# EAGLE design LoRaIOX_FW_RevA (EAGLE 7.2.0)
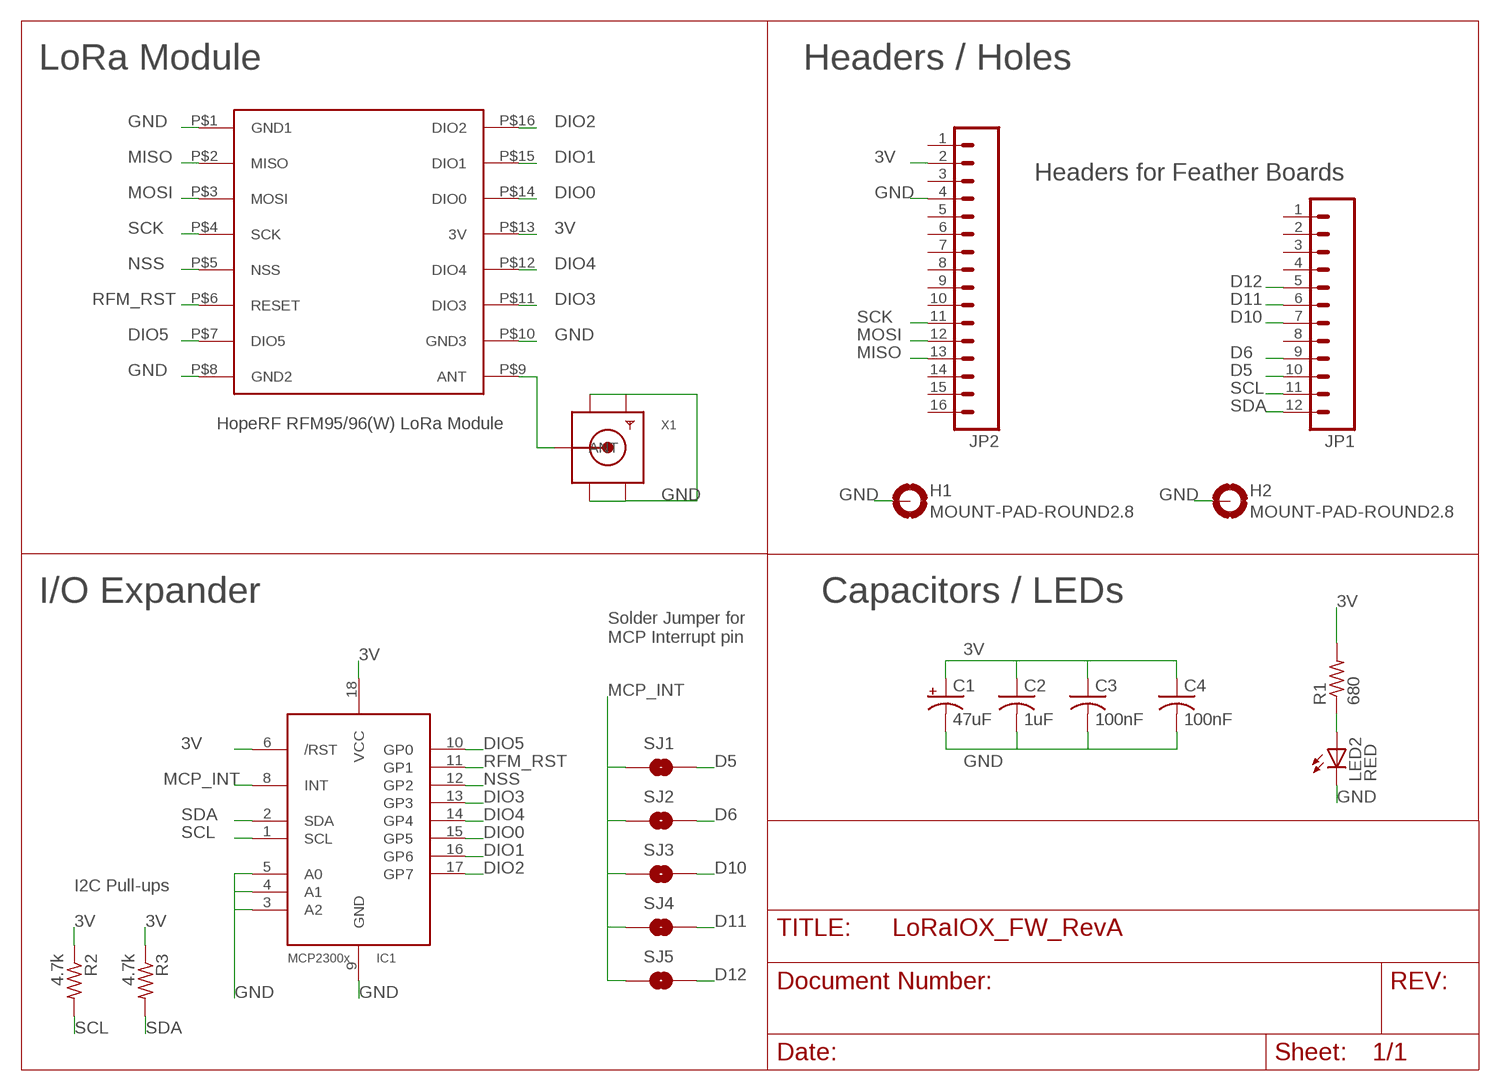
[diagram p0: schematic, sheet 1]

## Parts
C1  47uF  47UF-10V-10%(TANT)  [EIA3528]
C2  1uF  C-USC0603  [C0603]
C3  100nF  C-USC0603  [C0603]
C4  100nF  C-USC0603  [C0603]
H1  MOUNT-PAD-ROUND2.8  [2,8-PAD]
H2  MOUNT-PAD-ROUND2.8  [2,8-PAD]
IC1  MCP2300X/SO  [SO18W]
JP1  M12NO_SILK  [1X12_NO_SILK]
JP2  M161X16_NO_SILK  [1X16_NO_SILK]
LED2  RED  LEDCHIPLED_0805  [CHIPLED_0805]
R1  680  R-US_R0603  [R0603]
R2  4.7k  R-US_R0603  [R0603]
R3  4.7k  R-US_R0603  [R0603]
SJ1  JUMPER-PAD-2-NOYES_SILK  [PAD-JUMPER-2-NO_YES_SILK]
SJ2  JUMPER-PAD-2-NOYES_SILK  [PAD-JUMPER-2-NO_YES_SILK]
SJ3  JUMPER-PAD-2-NOYES_SILK  [PAD-JUMPER-2-NO_YES_SILK]
SJ4  JUMPER-PAD-2-NOYES_SILK  [PAD-JUMPER-2-NO_YES_SILK]
SJ5  JUMPER-PAD-2-NOYES_SILK  [PAD-JUMPER-2-NO_YES_SILK]
U$2  RFM95W  [RFM95W]
X1  SMACONNECTOR_EDGE  [SMA_EDGELAUNCH]

## Nets
3V: C1.A(+) C2.1 C3.1 C4.1 IC1.6(/RST) IC1.18(VCC) JP2.2 R1.2 R2.1 R3.1 U$2.P$13(3V)
ANT: U$2.P$9(ANT) X1.P(ANT)
D5: JP1.10 SJ1.2
D6: JP1.9 SJ2.2
D10: JP1.7 SJ3.2
D11: JP1.6 SJ4.2
D12: JP1.5 SJ5.2
DIO0: IC1.15(GP5) U$2.P$14(DIO0)
DIO1: IC1.16(GP6) U$2.P$15(DIO1)
DIO2: IC1.17(GP7) U$2.P$16(DIO2)
DIO3: IC1.13(GP3) U$2.P$11(DIO3)
DIO4: IC1.14(GP4) U$2.P$12(DIO4)
DIO5: IC1.10(GP0) U$2.P$7(DIO5)
GND: C1.C(-) C2.2 C3.2 C4.2 H1.B2,8(MOUNT) H2.B2,8(MOUNT) IC1.3(A2) IC1.4(A1) IC1.5(A0) IC1.9(GND) JP2.4 LED2.C U$2.P$1(GND1) U$2.P$8(GND2) U$2.P$10(GND3) X1.GND@1(GND4) X1.GND@2(GND3) X1.GND@3(GND2) X1.GND@4(GND1)
MCP_INT: IC1.8(INT) SJ1.1 SJ2.1 SJ3.1 SJ4.1 SJ5.1
MISO: JP2.13 U$2.P$2(MISO)
MOSI: JP2.12 U$2.P$3(MOSI)
N$9: LED2.A R1.1
NSS: IC1.12(GP2) U$2.P$5(NSS)
RFM_RST: IC1.11(GP1) U$2.P$6(RESET)
SCK: JP2.11 U$2.P$4(SCK)
SCL: IC1.1(SCL) JP1.11 R2.2
SDA: IC1.2(SDA) JP1.12 R3.2
Unconnected: JP1.1 JP1.2 JP1.3 JP1.4 JP1.8 JP2.1 JP2.3 JP2.5 JP2.6 JP2.7 JP2.8 JP2.9 JP2.10 JP2.14 JP2.15 JP2.16

## Notes on the sheet
- LoRa Module | Headers / Holes
- Headers for Feather Boards
- HopeRF RFM95/96(W) LoRa Module
- I/O Expander | Capacitors / LEDs
- Solder Jumper for
  MCP Interrupt pin
- I2C Pull-ups

## Library data of the parts
C1 = SparkFun-Capacitors:47UF-10V-10%(TANT): CAP-08310 47uF Tantalum SMT 10V 10% (EIA-3528); PROD_ID: CAP-08310
C2-C4 = adafruit:C-US: CAPACITOR, American symbol
H1 H2 = holes:MOUNT-PAD-ROUND: MOUNTING PAD, round
IC1 = adafruit:MCP2300X: MCP23008 Inexpensive i2c i/o expander - 8 general purpose i/o pins with optional pullups
JP1 = SparkFun-Connectors:M12: Header 12 Standard 12-pin 0.1" header. Use with straight break away headers (SKU : PRT-00116), right angle break away headers (PRT-00553), swiss pins (PRT-00743), machine pins (PRT-00117), and female headers (PRT-00115).
JP2 = SparkFun-Connectors:M16: 1x16 .1" header
LED2 = adafruit:LED: LED OSRAM: - CHIPLED LG R971, LG N971, LY N971, LG Q971, LY Q971, LO R971, LY R971 LH N974, LH R974 LS Q976, LO Q976, LY Q976 LO Q996 - Hyper CHIPLED LW Q18S LB Q993, LB Q99A, LB R99A - SideLED LS A670, LO A670, LY A670, LG A670, LP A670 LB A673, LV A673, LT A673, LW A673 LH A674 LY A675 LS A676, LA A676, LO A676, LY A676, LW A676 LS A679, LY A679, LG A679 - Hyper Micro SIDELED® LS Y876, LA Y876, LO Y876, LY Y876 LT Y87S - SmartLED LW L88C, LW L88S LB L89C, LB L89S, LG L890 LS L89K, LO L89K, LY L89K LS L896, LA L896, LO L896, LY L896 - TOPLED LS T670, LO T670, LY T670, LG T670, LP T670 LSG T670, LSP T670, LSY T670, LOP T670, LYG T670 LG T671, LOG T671, LSG T671 LB T673, LV T673, LT T673, LW T673 LH T674 LS T676, LA T676, LO T676, LY T676, LB T676, LH T676, LSB T676, LW T676 LB T67C, LV T67C, LT T67C, LS T67K, LO T67K, LY T67K, LW E67C LS E67B, LA E67B, LO E67B, LY E67B, LB E67C, LV E67C, LT E67C LW T67C LS T679, LY T679, LG T679 LS T770, LO T770, LY T770, LG T770, LP T770 LB T773, LV T773, LT T773, LW T773 LH T774 LS E675, LA E675, LY E675, LS T675 LS T776, LA T776, LO T776, LY T776, LB T776 LHGB T686 LT T68C, LB T68C - Hyper Mini TOPLED® LB M676 - Mini TOPLED Santana® LG M470 LS M47K, LO M47K, LY M47K Source: http://www.osram.convergy.de/
R1-R3 = adafruit2:R-US_: RESISTOR, American symbol
SJ1-SJ5 = SparkFun-Passives:JUMPER-PAD-2-NO
U$2 = _CustomParts:RFM95W
X1 = adafruit:SMACONNECTOR: SMA Connector 90° DIP SMA Connector, 50 Ohm (4UConnector: 07259)

## Net classes
1 power: width 0.305 mm

## Board
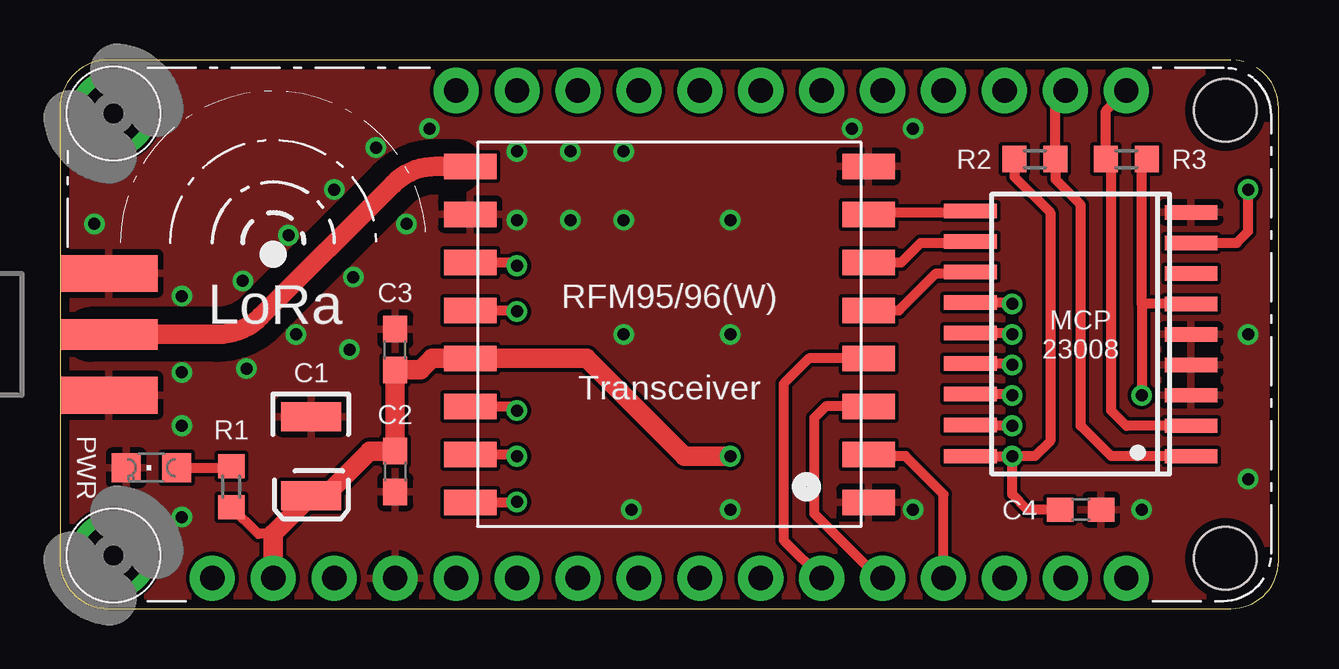
[diagram p1: board, top side]
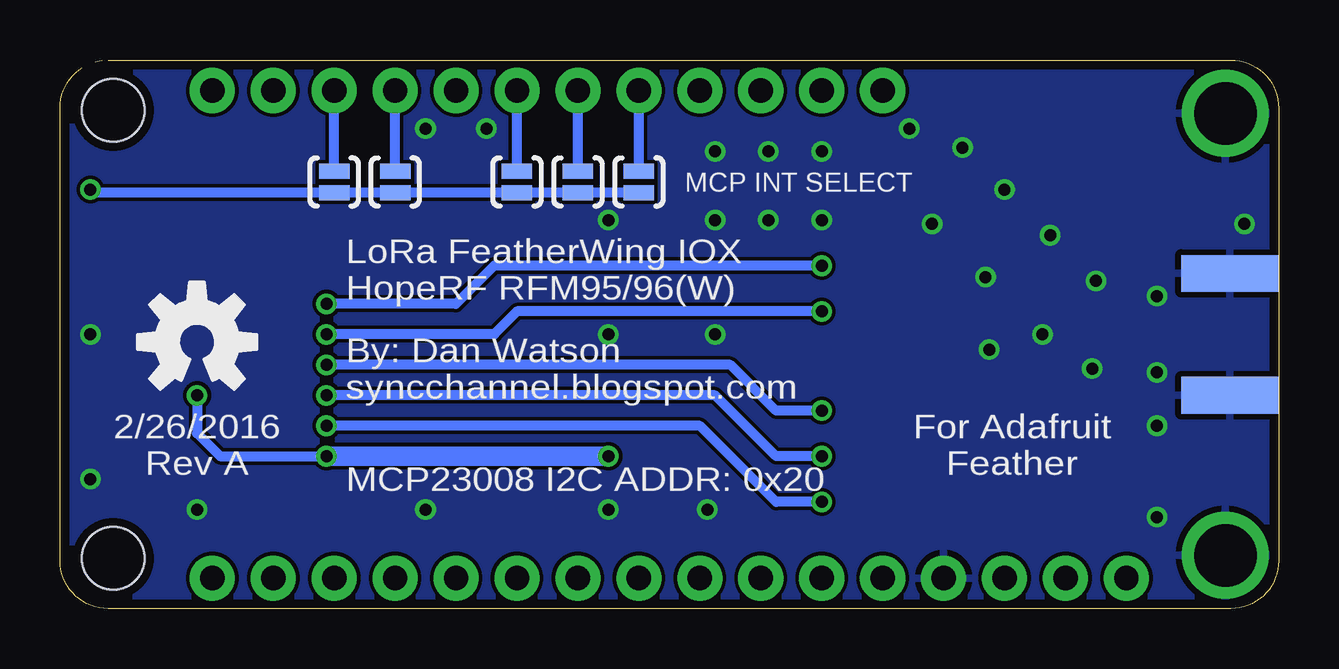
[diagram p2: board, bottom side, seen from below]

Size 50.8 x 22.86 mm. Coordinates in mm from the lower left corner, seen from the top.
Outline: 0,20.86 0,2 arc90 2,0 48.8,0 arc90 50.8,2 50.8,20.86 arc90 48.8,22.86 2,22.86 arc90 0,20.86
Copper layers (1*16): Top 0.0356mm / dielectric 1.5011mm / Bottom 0.0356mm
Design rules "oshpark-2layer *": minimum track width 6mil, minimum drill 13mil, track to track 6mil, track to pad 6mil, pad to pad 6mil, via to via 6mil, smd to smd 6mil, copper to edge 15mil, drill to drill 6mil, minimum pad ring 7mil, minimum via ring 7mil, stop-mask expansion 4mil, vias tented up to drill 20mil, thermal gap 10mil
Holes 2.6 mm at 48.58,20.76 48.58,2.1
tRestrict: 5 lines

### Footprints (pad centres in the part's own frame; a part is rotated, then mirrored left to right if it is on the bottom)
EIA3528 = smd 1.2 x 2.5: A 1.65,0; C -1.65,0
C0603 = smd 1.1 x 1: 1 -0.85,0; 2 0.85,0
2,8-PAD = drill 2.6 pad 3.6: B2,8 0,0
SO18W = smd 0.6 x 2.2: 1 -4.445,-4.6; 2 -3.175,-4.6; 3 -1.905,-4.6; 4 -0.635,-4.6; 5 0.635,-4.6; 6 1.905,-4.6; 7 3.175,-4.6; 8 4.445,-4.6; 9 5.715,-4.6; 10 5.775,4.6; 11 4.505,4.6; 12 3.235,4.6; 13 1.965,4.6; 14 0.695,4.6; 15 -0.575,4.6; 16 -1.845,4.6; 17 -3.145,4.6; 18 -4.445,4.6
1X12_NO_SILK = drill 1.016 pad 1.88: 1 0,0; 2 2.54,0; 3 5.08,0; 4 7.62,0; 5 10.16,0; 6 12.7,0; 7 15.24,0; 8 17.78,0; 9 20.32,0; 10 22.86,0; 11 25.4,0; 12 27.94,0
1X16_NO_SILK = drill 1.016 pad 1.88: 1 0,0; 2 2.54,0; 3 5.08,0; 4 7.62,0; 5 10.16,0; 6 12.7,0; 7 15.24,0; 8 17.78,0; 9 20.32,0; 10 22.86,0; 11 25.4,0; 12 27.94,0; 13 30.48,0; 14 33.02,0; 15 35.56,0; 16 38.1,0
CHIPLED_0805 = smd 1.2 x 1.2: A 0,-1.05; C 0,1.05
R0603 = smd 1 x 1.1: 1 -0.85,0; 2 0.85,0
PAD-JUMPER-2-NO_YES_SILK = smd 0.635 x 1.27: 1 -0.45,0; 2 0.45,0
RFM95W = smd 2.184 x 1.067: P$1 -8.3,7; P$2 -8.3,5; P$3 -8.3,3; P$4 -8.3,1; P$5 -8.3,-1; P$6 -8.3,-3; P$7 -8.3,-5; P$8 -8.3,-7; P$9 8.3,-7; P$10 8.3,-5; P$11 8.3,-3; P$12 8.3,-1; P$13 8.3,1; P$14 8.3,3; P$15 8.3,5; P$16 8.3,7
SMA_EDGELAUNCH = smd 4.064 x 1.524: GND@1 2.032,-2.54; GND@2 2.032,2.54 | smd 4.064 x 1.524 bottom: GND@3 2.032,2.54; GND@4 2.032,-2.54 | smd 4.064 x 1.27: P 2.032,0

### Placement (x,y rotation side)
C1  10.48,6.35 270 top
C2  13.97,10.79 90 top
C3  13.97,5.71 270 top
C4  42.55,4.13 0 top
H1  2.22,20.64 0 top
H2  2.22,2.22 0 top
IC1  42.55,10.79 90 top
JP1  16.51,21.59 0 top
JP2  6.35,1.27 0 top
LED2  3.81,5.87 90 top
R1  7.14,5.08 270 top
R2  40.64,18.73 0 top
R3  44.45,18.73 180 top
SJ1  39.37,17.78 90 bottom
SJ2  36.83,17.78 90 bottom
SJ3  31.75,17.78 90 bottom
SJ4  29.21,17.78 90 bottom
SJ5  26.67,17.78 90 bottom
U$1  [OSHW-LOGO-M]  45.09,11.11 0 bottom
U$2  25.4,11.43 180 top
X1  0,11.43 0 top

### Tracks (layer width: path | path; a pad name or v marks a point on that pad's centre or on a via)
3V  (via drill 0.5)
  Top 0.406: 8.89,3.11 8.26,3.11 R1.2 | 45.09,12.7 v45.09,8.89 | IC1.6 45.09,12.7 | IC1.18 v39.69,6.35 | C4.1 40.32,4.13 39.69,4.76 v39.69,6.35 | v39.69,6.35 40.64,6.35 41.27,6.99 41.27,16.51 39.79,18 R2.1 | 45.09,12.7 45.09,18.52 R3.1
  Top 0.813: JP2.2 8.89,3.11 C1.A 10.54,4.76 11.11,4.76 12.91,6.57 C3.1 C2.1 15.03,9.95 15.51,10.43 U$2.P$13 21.95,10.43 26.04,6.35 v27.94,6.35
  Bottom 0.406: v45.09,8.89 45.09,7.3 44.13,6.35 v39.69,6.35
  Bottom 0.813: v27.94,6.35 v39.69,6.35
ANT
  Top 0.813: U$2.P$9 15.67,18.43 arc45 13.88,17.69 8.36,12.17 arc-45 6.57,11.43 X1.P
  Top 1.016: 1.27,11.43 X1.P
D5
  Bottom 0.406: SJ1.2 JP1.10
D6
  Bottom 0.406: SJ2.2 JP1.9
D10
  Bottom 0.406: SJ3.2 JP1.7
D11
  Bottom 0.406: SJ4.2 JP1.6
D12
  Bottom 0.406: SJ5.2 JP1.5
DIO0  (via drill 0.5)
  Top 0.406: IC1.15 39.63,10.22 v39.69,10.16 | U$2.P$14 18.88,8.43 v19.05,8.26
  Bottom 0.406: v39.69,10.16 22.86,10.16 20.95,8.26 v19.05,8.26
DIO1  (via drill 0.5)
  Top 0.406: IC1.16 39.63,8.95 v39.69,8.89 | U$2.P$15 18.97,6.43 v19.05,6.35
  Bottom 0.406: v39.69,8.89 23.5,8.89 20.95,6.35 v19.05,6.35
DIO2  (via drill 0.5)
  Top 0.406: IC1.17 39.66,7.65 v39.69,7.62 | U$2.P$16 19.04,4.43 v19.05,4.45
  Bottom 0.406: v39.69,7.62 24.13,7.62 20.95,4.45 v19.05,4.45
DIO3  (via drill 0.5)
  Top 0.406: IC1.13 39.63,12.76 v39.69,12.7 | U$2.P$11 18.91,14.43 v19.05,14.29
  Bottom 0.406: v39.69,12.7 34.29,12.7 32.7,14.29 v19.05,14.29
DIO4  (via drill 0.5)
  Top 0.406: IC1.14 39.63,11.49 v39.69,11.43 | U$2.P$12 19,12.43 v19.05,12.38
  Bottom 0.406: v39.69,11.43 32.7,11.43 31.75,12.38 v19.05,12.38
DIO5
  Top 0.406: U$2.P$7 33.78,16.51 38.52,16.51 IC1.10
GND  (via drill 0.5)
  other vias: 5.08,13.02 5.08,9.84 7.62,13.65 7.78,10 9.53,15.56 11.43,17.46 13.18,19.21 15.4,20 14.45,16.03 12.22,13.81 35.56,4.13 23.5,16.19 27.94,11.43 23.5,11.43 9.84,11.43 5.08,3.81 5.08,7.62 45.09,4.13 19.05,16.19 12.06,10.79 1.43,16.03 23.81,4.13 27.94,4.13 35.56,20 49.53,11.43 49.53,5.4 33.02,20 21.27,16.19 21.27,19.05 23.5,19.05 19.05,19.05 27.94,16.19
  pour Top: -6.35,26.67 -6.35,-3.81 54.61,-3.81 54.61,26.67
  pour Bottom: -7.62,27.94 -7.62,-5.08 55.88,-5.08 55.88,29.21 -7.62,29.21
MCP_INT  (via drill 0.5)
  Top 0.406: IC1.8 49.05,15.24 49.53,15.72 v49.53,17.46
  Bottom 0.406: SJ5.1 SJ4.1 SJ3.1 SJ2.1 SJ1.1 49.4,17.33 v49.53,17.46
MISO
  Top 0.406: JP2.13 36.83,4.76 35.24,6.35 33.78,6.35
  Top 0.61: 33.78,6.35 U$2.P$2
MOSI
  Top 0.406: U$2.P$3 31.93,8.43 31.43,7.94 31.43,3.97 34.13,1.27
  Top 0.61: JP2.12 34.13,1.27
N$9
  Top 0.406: LED2.A 7.09,5.87 R1.1
NSS
  Top 0.406: U$2.P$5 34.97,12.43 36.51,13.97 38.52,13.97 IC1.12
RFM_RST
  Top 0.406: U$2.P$6 35.07,14.43 35.88,15.24 38.52,15.24 IC1.11
SCK
  Top 0.406: U$2.P$4 31.23,10.43 30.16,9.37 30.16,2.86 JP2.11
SCL
  Top 0.406: IC1.1 43.81,6.35 42.55,7.62 42.55,16.83 41.49,17.88 R2.2 41.49,21.17 JP1.11
SDA
  Top 0.406: IC1.2 44.45,7.62 43.81,8.26 43.81,18.52 R3.2 43.6,20.74 JP1.12

### Text on the board
tNames: R2 | R3 | LoRa | C3 | RFM95/96(W) | MCP / 23008 | C1 | Transceiver | C2 | R1 | PWR | C4
bNames: MCP INT SELECT | LoRa FeatherWing IOX / HopeRF RFM95/96(W) | By: Dan Watson / syncchannel.blogspot.com | For Adafruit / Feather | 2/26/2016 / Rev A | MCP23008 I2C ADDR: 0x20